# Altium schematic sheet MCU.SchDoc
size A4
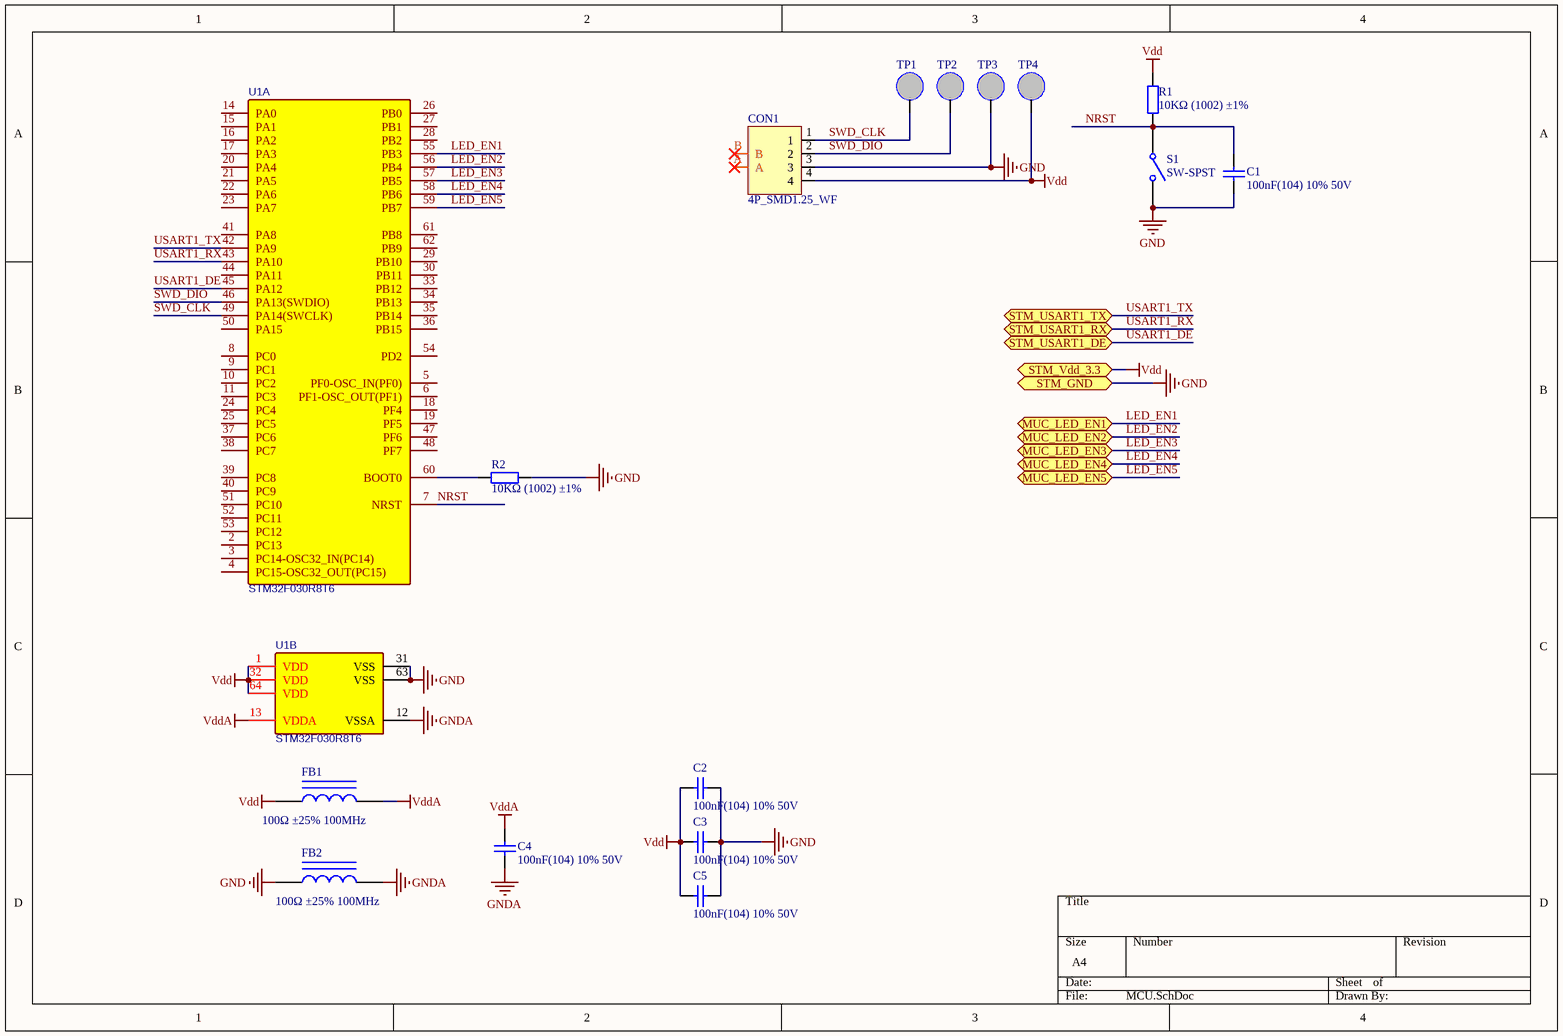
[diagram p0: MCU.SchDoc]

## Parts
C1  100nF(104) 10% 50V  [0805_C]
C2  100nF(104) 10% 50V  [0805_C]
C3  100nF(104) 10% 50V  [0805_C]
C4  100nF(104) 10% 50V  [0805_C]
C5  100nF(104) 10% 50V  [0805_C]
CON1  4P_SMD1.25_WF  [MX 1.25-LS-4P]
FB1  100Ω ±25% 100MHz  [0805_L]
FB2  100Ω ±25% 100MHz  [0805_L]
R1  10KΩ (1002) ±1%  [0805_R]
R2  10KΩ (1002) ±1%  [0805_R]
S1  SW-SPST  [key]
TP1  TP  [TP]  (value not drawn)
TP2  TP  [TP]  (value not drawn)
TP3  TP  [TP]  (value not drawn)
TP4  TP  [TP]  (value not drawn)
U1  STM32F030R8T6  [LQFP-64_10X10X05P]  (parts A,B of 2)

## Ports
MUC_LED_EN1, MUC_LED_EN2, MUC_LED_EN3, MUC_LED_EN4, MUC_LED_EN5, STM_GND, STM_USART1_DE, STM_USART1_RX, STM_USART1_TX, STM_Vdd_3.3

## Nets
GND: C1.1 C2.1 C3.1 C5.1 CON1.3 FB2.1 R2.2 S1.2(NO) TP3.1 U1.31(VSS) U1.63(VSS) ; port STM_GND
GNDA: C4.1 FB2.2 U1.12(VSSA)
Vdd: C2.2 C3.2 C5.2 CON1.4 FB1.1 R1.2 TP4.1 U1.1(VDD) U1.32(VDD) U1.64(VDD) ; port STM_Vdd_3.3
VddA: C4.2 FB1.2 U1.13(VDDA)
LED_EN1: U1.55(PB3) ; port MUC_LED_EN1
LED_EN2: U1.56(PB4) ; port MUC_LED_EN2
LED_EN3: U1.57(PB5) ; port MUC_LED_EN3
LED_EN4: U1.58(PB6) ; port MUC_LED_EN4
LED_EN5: U1.59(PB7) ; port MUC_LED_EN5
NRST: C1.2 R1.1 S1.1(COMMON) U1.7(NRST)
SWD_CLK: CON1.1 TP1.1 U1.49(PA14(SWCLK))
SWD_DIO: CON1.2 TP2.1 U1.46(PA13(SWDIO))
USART1_DE: U1.45(PA12) ; port STM_USART1_DE
USART1_RX: U1.43(PA10) ; port STM_USART1_RX
USART1_TX: U1.42(PA9) ; port STM_USART1_TX
NetR2_1: R2.1 U1.60(BOOT0)

Not connected (* = marked no-connect by the designer): CON1 A* B*; U1 2(PC13) 3(PC14-OSC32_IN(PC14)) 4(PC15-OSC32_OUT(PC15)) 5(PF0-OSC_IN(PF0)) 6(PF1-OSC_OUT(PF1)) 8(PC0) 9(PC1) 10(PC2) 11(PC3) 14(PA0) 15(PA1) 16(PA2) 17(PA3) 18(PF4) 19(PF5) 20(PA4) 21(PA5) 22(PA6) 23(PA7) 24(PC4) 25(PC5) 26(PB0) 27(PB1) 28(PB2) 29(PB10) 30(PB11) 33(PB12) 34(PB13) 35(PB14) 36(PB15) 37(PC6) 38(PC7) 39(PC8) 40(PC9) 41(PA8) 44(PA11) 47(PF6) 48(PF7) 50(PA15) 51(PC10) 52(PC11) 53(PC12) 54(PD2) 61(PB8) 62(PB9)

## Library data of the parts
C1-C5 = 0805 100nF(104) 10% 50V: 贴片电容; ComponentLink1Description: 供应商链接; ComponentLink1URL: http://www.szlcsc.com/product/details_50686.html; Package: 0805; Supplier: LC; SuppliersPartNumber: C49678
CON1 = 4P_XH2.54_W
FB1 FB2 = 0805 100Ω 25% 100MHz: 贴片磁珠; ComponentLink1Description: 供应商链接; ComponentLink1URL: http://www.szlcsc.com/product/details_1367.html; Package: 0805; Supplier: LC; SuppliersPartNumber: C1015
R1 R2 = 0805 10KΩ (1002) 1%: 贴片电阻; ComponentLink1Description: 供应商链接; ComponentLink1URL: http://www.szlcsc.com/product/details_18102.html; Package: 0805; Supplier: LC; SuppliersPartNumber: C17414
S1 = SW-SPST: Single-Pole, Single-Throw Switch; Published: 24-Mar-1999; LatestRevisionDate: 17-Jul-2002; LatestRevisionNote: Re-released for DXP Platform.; PackageReference: SPST-2; Publisher: Altium Limited; PackageDescription: Switch; 2 Leads
U1 = STM32F030R8T6: BOM_Manufacturer: ST; subpart_no: 1; tags: STM32; BOM_Supplier Part: C39105; BOM_Supplier: LCSC; BOM_Manufacturer Part: STM32F030R8T6; image: http://image.lceda.cn/szlcsc/C39105.jpg; spicePre: U